# Altium schematic sheet INPUT_PROTECTION.SchDoc
size A; SheetNumber: 5; SheetTotal: 21
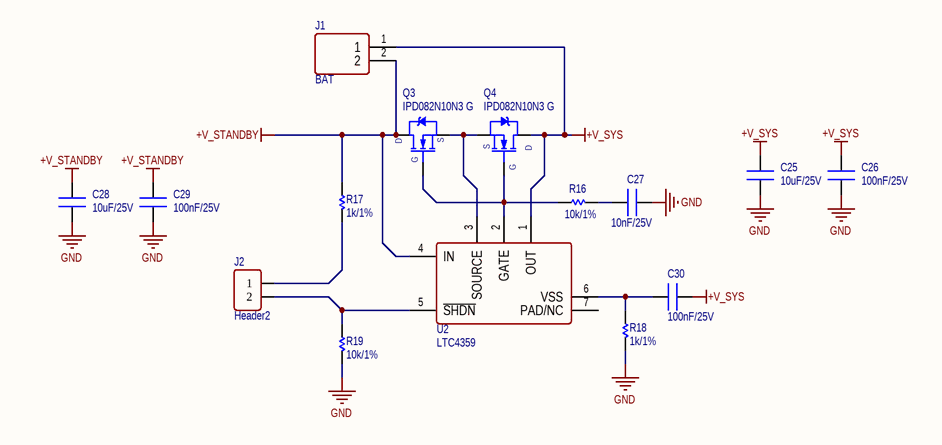
[diagram p0: INPUT_PROTECTION.SchDoc]

## Parts
C25  10uF/25V  [CN-SMD-0603]
C26  100nF/25V  [CN-SMD-0603]
C27  10nF/25V  [CN-SMD-0603]
C28  10uF/25V  [CN-SMD-0603]
C29  100nF/25V  [CN-SMD-0603]
C30  100nF/25V  [CN-SMD-0603]
J1  BAT  [S2P-VH(LF)(SN)]
J2  Header2  [XH2.54-2-DIP]
Q3  IPD082N10N3 G  [TO252-123]
Q4  IPD082N10N3 G  [TO252-123]
R16  10k/1%  [RES-SMD-0603]
R17  1k/1%  [RES-SMD-0603]
R18  1k/1%  [RES-SMD-0603]
R19  10k/1%  [RES-SMD-0603]
U2  LTC4359  [VSSOP8]

## Nets
+V_STANDBY: C28.2 C29.2 J1.2 Q3.2(D) R17.1 U2.4(IN)
+V_SYS: C25.2 C26.2 C30.2 J1.1 Q4.2(D) U2.1(OUT)
GND: C25.1 C26.1 C27.1 C28.1 C29.1 R18.2 R19.2
NetC27_2: C27.2 R16.2
NetC30_1: C30.1 R18.1 U2.6(VSS)
NetJ2_1: J2.1 R17.2
NetJ2_2: J2.2 R19.1 U2.5(~{SHDN})
NetQ3_1: Q3.1(G) Q4.1(G) R16.1 U2.2(GATE)
NetQ3_3: Q3.3(S) Q4.3(S) U2.3(SOURCE)

Not connected (* = marked no-connect by the designer): U2 7(PAD/NC)

## Library data of the parts
C25 C28 = CN: 0603W106M250XD; PN: 0603W106M250XD
C26 C29 C30 = CN: CL10B104KA8NNNC; PN: CL10B104KA8NNNC
C27 = CN: CL10B103KB8NNNC; PN: CL10B103KB8NNNC
J1 = KF2: S2P-VH; ComponentLink1 Description: Manufacturer; ComponentLink2 Description: Datasheet; PN: S2P-VH; ComponentLink1URL: http://www.we-online.com; ComponentLink2URL: http://katalog.we-online.de/em/datasheet/6911031100xx.pdf
J2 = Header2: Connector 2; Manufacturer: W¨¹rth Elektronik eiSos GmbH; partNo: 613002143121; ComponentLink1 Description: Manufacturer; ComponentLink2 Description: Datasheet; NoPins: 02; Created Date: 29 March 2013; ComponentLink1URL: http://www.we-online.com; ComponentLink2URL: http://katalog.we-online.de/em/datasheet/6130xx143121.pdf; Created by: Karrer Zheng
Q3 Q4 = FDD8870: PN: IPD082N10N3 G
R16 R19 = Res-SMD: ERJ-3EKF1002V; Manufacturer: Generic Components; Class: Passive; PN: ERJ-3EKF1002V; Publisher: Altium Hobart Technology Centre
R17 R18 = Res-SMD: ERJ-3EKF1001V; Manufacturer: Generic Components; Class: Passive; PN: ERJ-3EKF1001V; Publisher: Altium Hobart Technology Centre
U2 = LTC4359: Ideal Diode Controller with Reverse Input Protection; pin to pad: 1>8 2>1 3>2; PN: LTC4359CMS8#TRPBF